# Altium schematic sheet SD_card.SchDoc
size A4; SheetNumber: 10; SheetTotal: 10
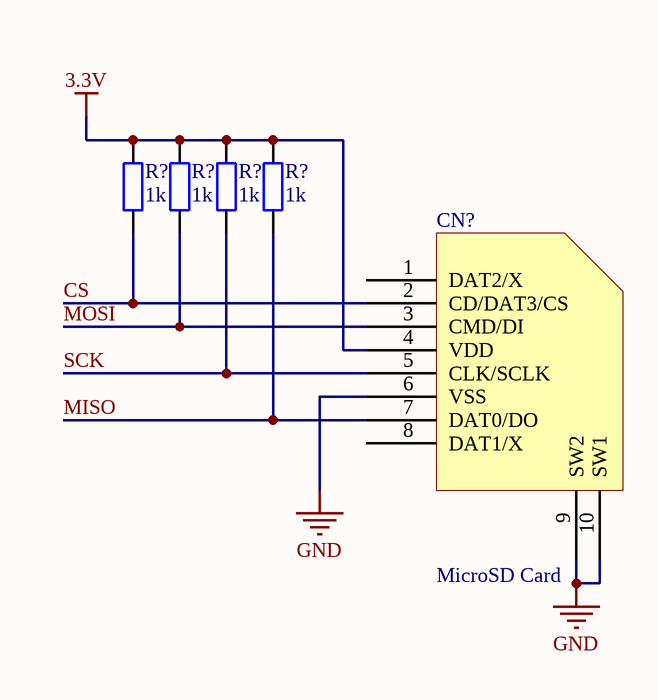
[diagram p0: SD_card.SchDoc]

## Parts
(Parts that share a designator on the sheet are numbered #1, #2 ... from top to bottom, then left to right.)
CN?  MicroSD Card  [MicroSD Card]
R?#1  1k  [tro smd 0805]
R?#2  1k  [tro smd 0805]
R?#3  1k  [tro smd 0805]
R?#4  1k  [tro smd 0805]

## Nets
3.3V: CN?.4(VDD) R?#1.1 R?#2.2 R?#3.2 R?#4.2
GND: CN?.6(VSS) CN?.9(SW2) CN?.10(SW1)
CS: CN?.2(CD/DAT3/CS) R?#1.2
MISO: CN?.7(DAT0/DO) R?#4.1
MOSI: CN?.3(CMD/DI) R?#2.1
SCK: CN?.5(CLK/SCLK) R?#3.1

Not connected (* = marked no-connect by the designer): CN? 1(DAT2/X) 8(DAT1/X)

## Library data of the parts
R?#1-R?#4 = Tro 0805 1% 1k: Dán; Don_Vi: Con; So_Chan: 2; Ten_Linh_Kien: Trở 0805 1% 1k; Ma_Hang: MH005468; Chung_Loai: Dán; Kieu_Chan: *